# Altium project lp_ecg.PrjPcb
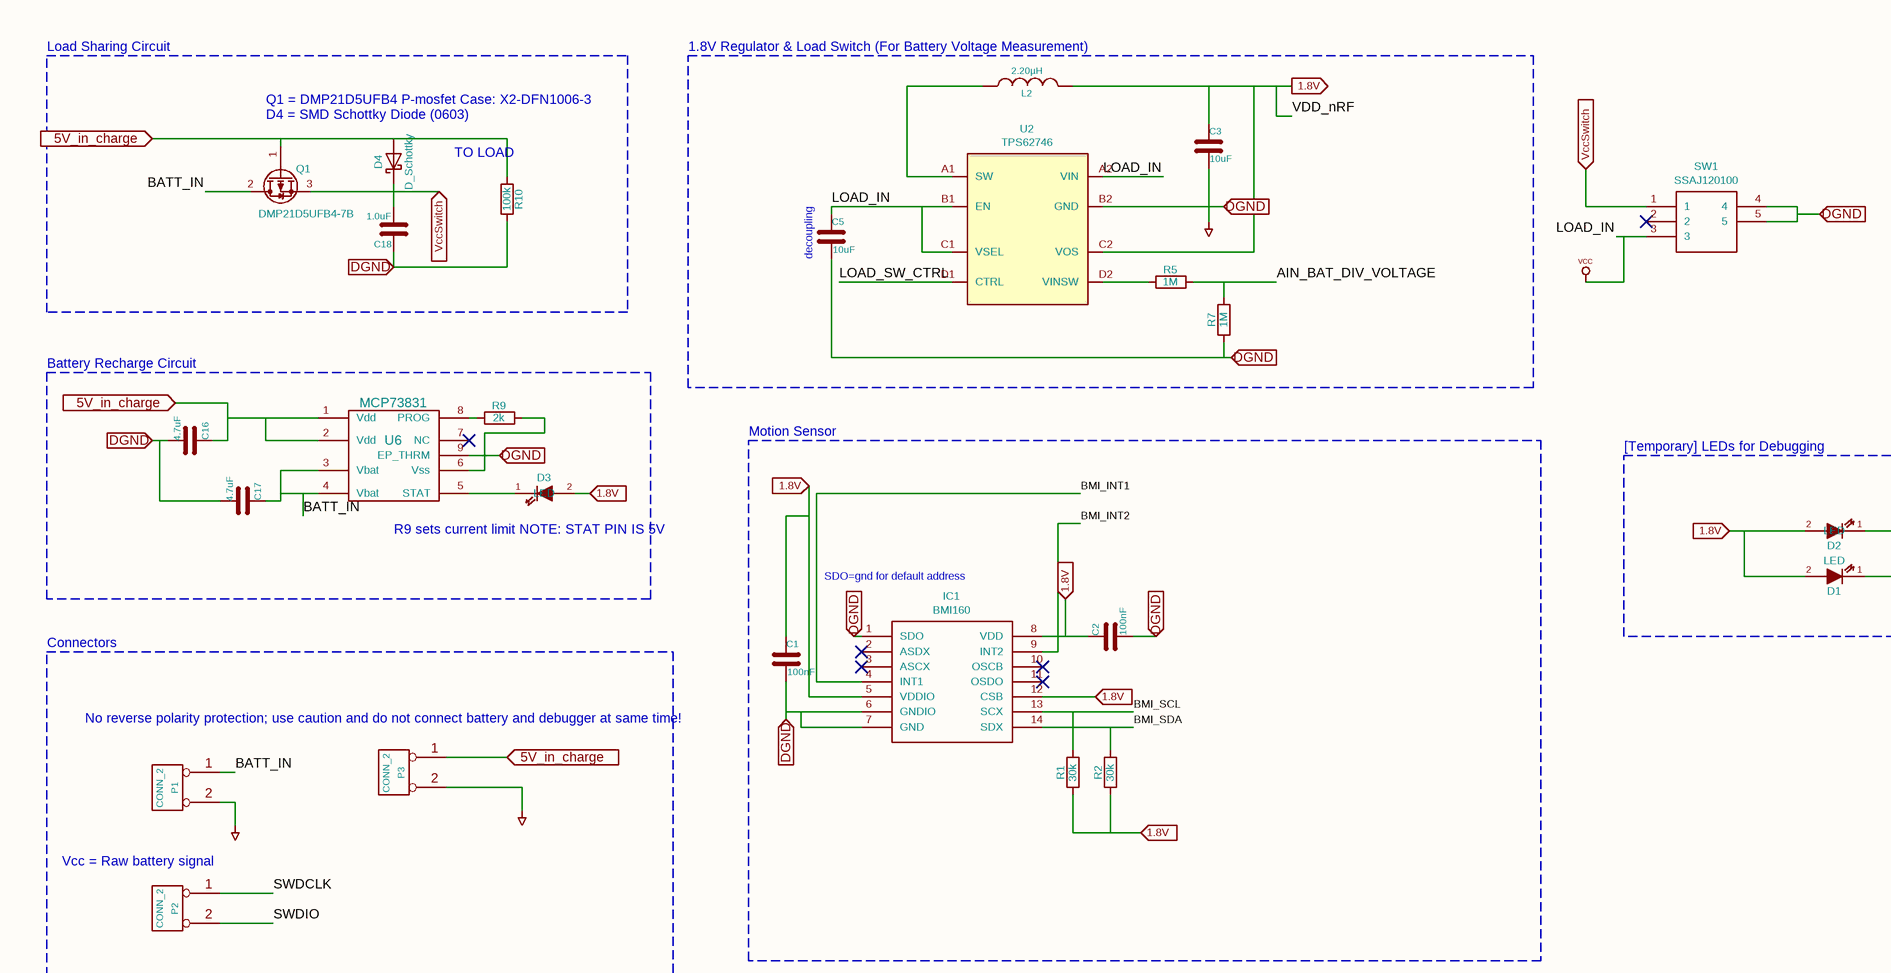
[diagram p0: lp_ecg.SchDoc, top left]
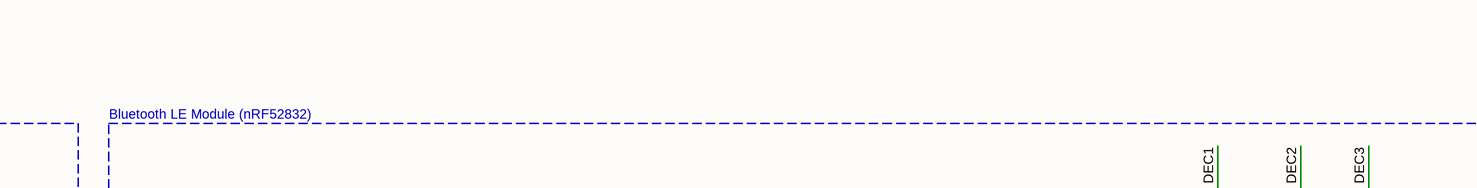
[diagram p1: lp_ecg.SchDoc, top right]
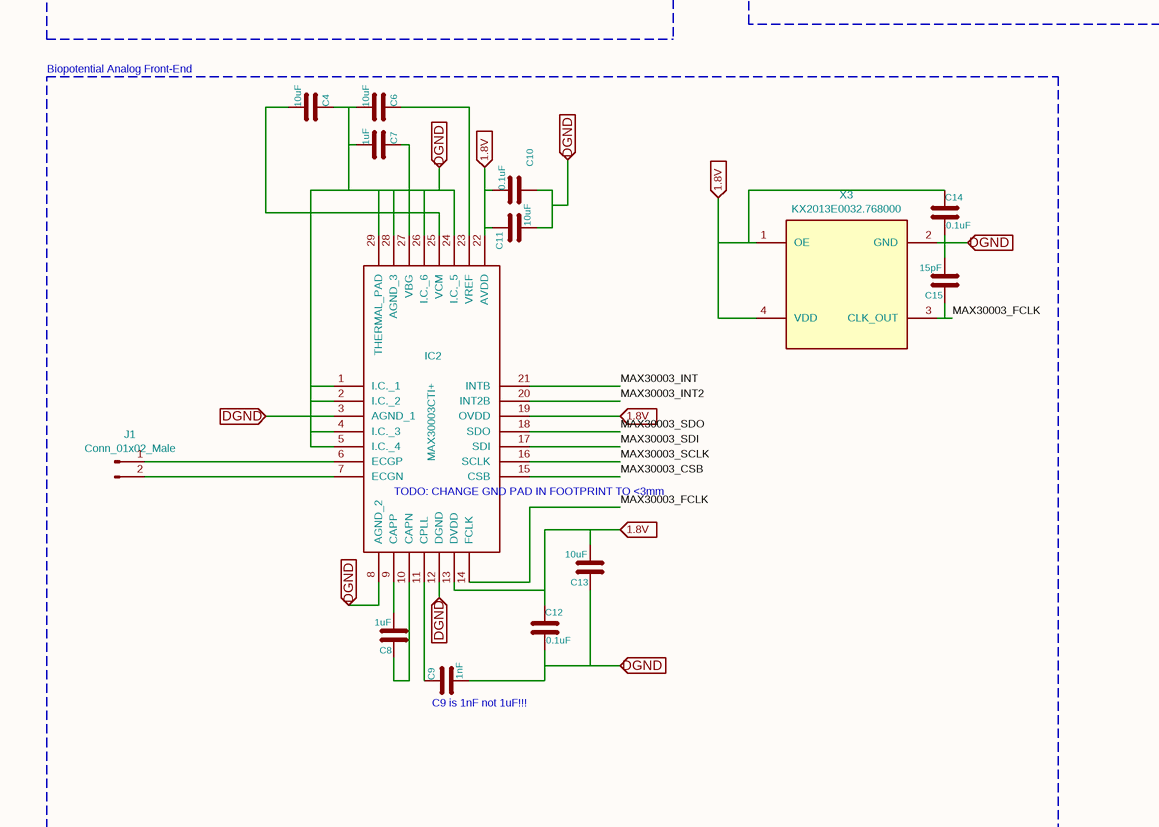
[diagram p2: lp_ecg.SchDoc, bottom left]
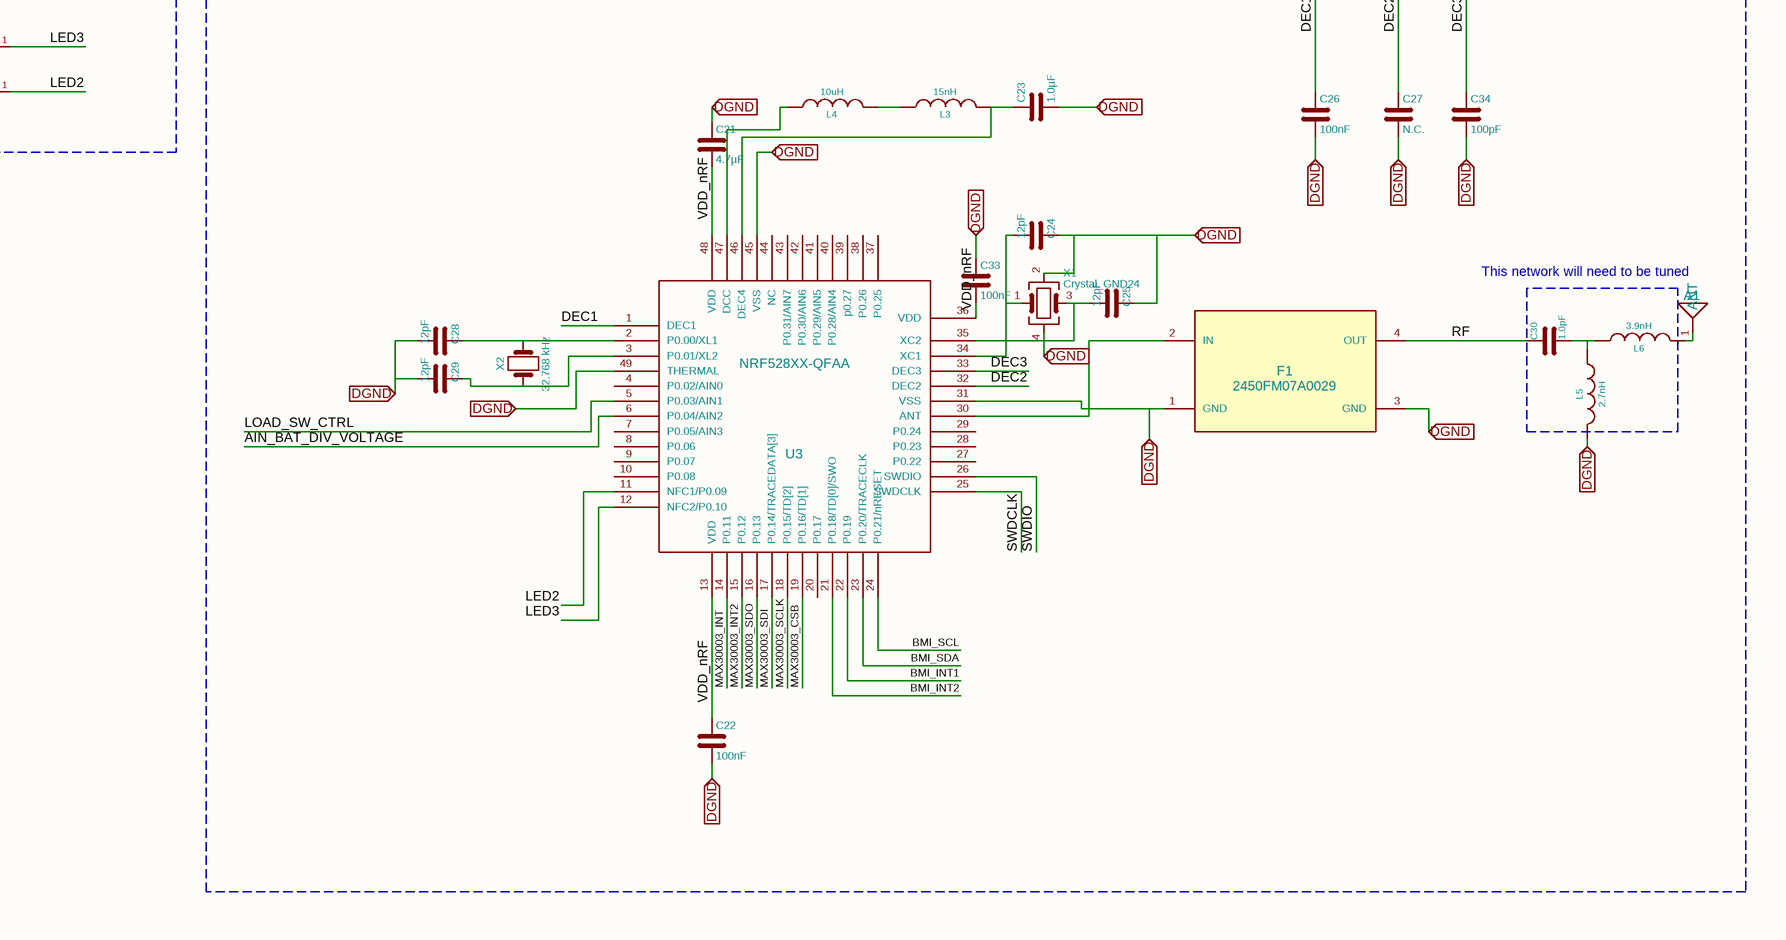
[diagram p3: lp_ecg.SchDoc, bottom right]
1 sheet, 61 parts. Net scope: flat (ports and power ports of the same name join across sheets).
Board files: lp_ecg.PcbDoc, lp_ecg(1).PcbDoc

## Sheet lp_ecg.SchDoc
size 840 x 594 mm

### Parts
A1  CHIP-ANT  (value not drawn)
C1  100nF  [C_0402]
C2  100nF  [C_0402]
C3  10uF  [C_0402]
C4  10uF  [C_0402]
C5  10uF  [C_0402]
C6  10uF  [C_0402]
C7  1uF  [C_0402]
C8  1uF  [C_0402]
C9  1nF  [C_0402]
C10  0.1uF  [C_0402]
C11  10uF  [C_0402]
C12  0.1uF  [C_0402]
C13  10uF  [C_0402]
C14  0.1uF  [C_0402]
C15  15pF  [C_0402]
C16  4.7uF  [C_0402]
C17  4.7uF  [C_0402]
C18  1.0uF  [C_0402]
C21  4.7µF  [C_0402]
C22  100nF  [C_0603]
C23  1.0µF  [C_0603]
C24  12pF  [C_0402]
C25  12pF  [C_0402]
C26  100nF  [C_0402]
C27  N.C.
C28  12pF  [C_0402]
C29  12pF  [C_0402]
C30  1.0pF  [C_0402]
C33  100nF  [C_0402]
C34  100pF  [C_0402]
D1  LED  [LED_0603]
D2  LED  [LED_0603]
D3  LED  [LED_0603]
D4  D_Schottky  [LED_0603]
F1  2450FM07A0029
IC1  BMI160  [BMI160]
IC2  MAX30003CTI+  [QFN50P500X500X80-29N]
J1  Conn_01x02_Male
L2  2.20µH  [L_0603]
L3  15nH  [L_0402]
L4  10uH  [L_0603]
L5  2.7nH  [L_0402]
L6  3.9nH  [L_0402]
P1  CONN_2  [Pin_Header_Straight_1x02_Pitch2.54mm]
P2  CONN_2  [Pin_Header_Straight_1x02_Pitch2.54mm]
P3  CONN_2  [Pin_Header_Straight_1x02_Pitch2.54mm]
Q1  DMP21D5UFB4-7B  [X2-DFN1006]
R1  30k  [R_0402]
R2  30k  [R_0402]
R5  1M  [R_0402]
R7  1M  [R_0402]
R9  2k  [R_0402]
R10  100k  [R_0402]
SW1  SSAJ120100  [SSAJ120100]
U2  TPS62746
U3  NRF528XX-QFAA  [UQFN-48-1EP_6x6mm_Pitch0.4mm]
U6  MCP73831  [DFN-8-1EP_2x3mm_Pitch0.5mm]
X1  Crystal_GND24  [Crystal_SMD_2016-4pin_2.0x1.6mm]
X2  32.768 kHz  [Crystal_SMD_2012-2pin_2.0x1.2mm]
X3  KX2013E0032.768000  [Crystal_SMD_2016-4pin_2.0x1.6mm]

### Blocks framed on the sheet
decoupling: C3 C5 L2 R5 R7 U2
Motion Sensor: C1 C2 IC1 R1 R2
[Temporary] LEDs for Debugging: D1 D2

### Ports
1.8V (in), 1.8V (out), 5V_in_charge (in), DGND (in), VccSwitch (in)

### Nets
GND: C1.2 C2.2 C3.2 C4.1 C5.2 C6.2 C7.2 C9.2 C10.1 C11.2 C12.2 C13.1 C14.2 C15.2 C16.2 C17.2 C18.1 C21.1 C22.2 C23.2 C24.1 C25.1 C26.2 C27.2 C28.2 C29.2 C33.1 C34.2 F1.1(GND) F1.2(IN) F1.3(GND) IC1.1(SDO) IC1.6(GNDIO) IC1.7(GND) IC2.1(I.C._1) IC2.2(I.C._2) IC2.3(AGND_1) IC2.4(I.C._3) IC2.5(I.C._4) IC2.8(AGND_2) IC2.12(DGND) IC2.24(I.C._5) IC2.26(I.C._6) IC2.28(AGND_3) IC2.29(THERMAL_PAD) L5.2 P1.2(PM) P3.2(PM) R7.1 R9.2 R10.2 SW1.4 SW1.5 U2.B2(GND) U3.30(ANT) U3.31(VSS) U3.45(VSS) U3.49(THERMAL) U6.6(Vss) U6.9(EP_THRM) X1.2 X1.4 X3.2(GND) ; port DGND
LOAD_IN: C5.1 SW1.3 U2.A2(VIN) U2.B1(EN) U2.C1(VSEL)  [also labelled VCC]
5V_in_charge: C16.1 D4.2(A) P3.1(P1) Q1.1(G) R10.1 U6.1(Vdd) U6.2(Vdd) ; port 5V_in_charge
AIN_BAT_DIV_VOLTAGE: R5.2 R7.2 U3.6(P0.04/AIN2)
BATT_IN: C17.1 P1.1(P1) Q1.2(D) U6.3(Vbat) U6.4(Vbat)
BMI_INT1: IC1.4(INT1) U3.22(P0.19)
BMI_INT2: IC1.9(INT2) U3.21(P0.18/TD[0]/SWO)
BMI_SCL: IC1.13(SCX) R1.2 U3.24(P0.21/nRESET)
BMI_SDA: IC1.14(SDX) R2.2 U3.23(P0.20/TRACECLK)
DEC1: C26.1 U3.1(DEC1)
DEC2: C27.1 U3.32(DEC2)
DEC3: C34.1 U3.33(DEC3)
LED2: D1.1(K) U3.11(NFC1/P0.09)
LED3: D2.1(K) U3.12(NFC2/P0.10)
LOAD_SW_CTRL: U2.D1(CTRL) U3.5(P0.03/AIN1)
MAX30003_CSB: IC2.15(CSB) U3.19(P0.16/TD[1])
MAX30003_FCLK: C15.1 IC2.14(FCLK) X3.3(CLK_OUT)
MAX30003_INT: IC2.21(INTB) U3.14(P0.11)
MAX30003_INT2: IC2.20(INT2B) U3.15(P0.12)
MAX30003_SCLK: IC2.16(SCLK) U3.18(P0.15/TD[2])
MAX30003_SDI: IC2.17(SDI) U3.17(P0.14/TRACEDATA[3])
MAX30003_SDO: IC2.18(SDO) U3.16(P0.13)
RF: C30.1 F1.4(OUT)
SWDCLK: P2.1(P1) U3.25(SWDCLK)
SWDIO: P2.2(PM) U3.26(SWDIO)
VccSwitch: C18.2 D4.1(K) Q1.3(S) SW1.1 ; port VccSwitch
VDD_nRF: C1.1 C2.1 C3.1 C10.2 C11.1 C12.1 C13.2 C14.1 C21.2 C22.1 C33.2 D1.2(A) D2.2(A) D3.2(A) IC1.5(VDDIO) IC1.8(VDD) IC1.12(CSB) IC2.13(DVDD) IC2.19(OVDD) IC2.22(AVDD) L2.2 R1.1 R2.1 U2.C2(VOS) U3.13(VDD) U3.36(VDD) U3.48(VDD) X3.1(OE) X3.4(VDD) ; port 1.8V
NetA1_1: A1.1(ANT) L6.2
NetC4_2: C4.2 IC2.25(VCM)
NetC6_1: C6.1 IC2.23(VREF)
NetC7_1: C7.1 IC2.27(VBG)
NetC8_1: C8.1 IC2.10(CAPN)
NetC8_2: C8.2 IC2.9(CAPP)
NetC9_1: C9.1 IC2.11(CPLL)
NetC23_1: C23.1 L3.2 U3.46(DEC4)
NetC24_2: C24.2 U3.34(XC1) X1.1
NetC25_2: C25.2 U3.35(XC2) X1.3
NetC28_1: C28.1 U3.2(P0.00/XL1) X2.2
NetC29_1: C29.1 U3.3(P0.01/XL2) X2.1
NetC30_2: C30.2 L5.1 L6.1
NetD3_1: D3.1(K) U6.5(STAT)
NetIC2_6: IC2.6(ECGP) J1.1(Pin_1)
NetIC2_7: IC2.7(ECGN) J1.2(Pin_2)
NetL2_1: L2.1 U2.A1(SW)
NetL3_1: L3.1 L4.2
NetL4_1: L4.1 U3.47(DCC)
NetR5_1: R5.1 U2.D2(VINSW)
NetR9_1: R9.1 U6.8(PROG)

Not connected (* = marked no-connect by the designer): A1 2(NC); IC1 2(ASDX)* 3(ASCX)* 10(OSCB)* 11(OSDO)*; SW1 2*; U3 4(P0.02/AIN0) 7(P0.05/AIN3) 8(P0.06) 9(P0.07) 10(P0.08) 20(P0.17) 27(P0.22) 28(P0.23) 29(P0.24) 37(P0.25) 38(P0.26) 39(p0.27) 40(P0.28/AIN4) 41(P0.29/AIN5) 42(P0.30/AIN6) 43(P0.31/AIN7) 44(NC); U6 7(NC)*

### Notes on the sheet
- Load Sharing Circuit
- (near L2) 1.8V Regulator & Load Switch (For Battery Voltage Measurement)
- Q1 = DMP21D5UFB4 P-mosfet
  Case: X2-DFN1006-3
- (near D4) D4 = SMD Schottky Diode (0603)
- (near R10) TO LOAD
- Battery Recharge Circuit
- Bluetooth LE Module (nRF52832)
- R9 sets current limit
  NOTE: STAT PIN IS 5V
- SDO=gnd for default address
- Connectors
- No reverse polarity protection;
  use caution and do not connect
  battery and debugger at same time!
- This network will need to be tuned
- (near P2) Vcc = Raw battery signal
- Biopotential Analog Front-End
- (near IC2) TODO: CHANGE GND PAD IN FOOTPRINT TO <3mm
- (near C9) C9 is 1nF not 1uF!!!
- 1
- 2
- 3
- 4
- 5
- 6
- 7
- 8
- 9
- 10
- 11
- 12
- 13
- 14
- 15
- 16
- A
- B
- C
- D
- E
- F
- G
- H
- I
- J
- K
- Title:
- File: lp_ecg.sch
- Sheet: /
- KiCad E.D.A.  kicad (5.1.4)-1
- Size: A1
- Date: 19 feb 2016
- Rev:
- Id: 1/1

### Library data of the parts
C1-C18 C21-C30 C33 C34 = C
  C1 C2 C26 C33: Value: 100nF; Footprint: Capacitors_SMD:C_0402
  C3-C6 C11 C13: Value: 10uF; Footprint: Capacitors_SMD:C_0402
  C7 C8: Value: 1uF; Footprint: Capacitors_SMD:C_0402
  C9: Value: 1nF; Footprint: Capacitors_SMD:C_0402
  C10 C12 C14: Value: 0.1uF; Footprint: Capacitors_SMD:C_0402
  C15: Value: 15pF; Footprint: Capacitors_SMD:C_0402
  C16 C17: Value: 4.7uF; Footprint: Capacitors_SMD:C_0402
  C18: Value: 1.0uF; Footprint: Capacitors_SMD:C_0402
  C21: Value: 4.7µF; Footprint: Capacitors_SMD:C_0402
  C22: Value: 100nF; Footprint: Capacitors_SMD:C_0603
  C23: Value: 1.0µF; Footprint: Capacitors_SMD:C_0603
  C24 C25 C28 C29: Value: 12pF; Footprint: Capacitors_SMD:C_0402
  C27: Value: N.C.
  C30: Value: 1.0pF; Footprint: Capacitors_SMD:C_0402
  C34: Value: 100pF; Footprint: Capacitors_SMD:C_0402
D1-D3 = LED-RESCUE-EEG_ADS1299_2: Value: LED; Footprint: LEDs:LED_0603
IC1 = BMI160: Manufacturer_Name: Bosch; Description: IMUs - Inertial Measurement Units 6-Axis 950uA; Height: 0.88; Mouser Part Number: 262-BMI160; Manufacturer_Part_Number: BMI160; Value: BMI160; Footprint: BMI160:BMI160
IC2 = MAX30003CTI+: Manufacturer_Name: Maxim Integrated; Description: MAXIM INTEGRATED PRODUCTS - MAX30003CTI+ - BIOPOTENTIAL AFE, ECG/R-R DETECT, TQFN28; Height: 0.8; Mouser Part Number: 700-MAX30003CTI+; Mouser Price/Stock: https://www.mouser.com/Search/Refine.aspx?Keyword=700-MAX30003CTI%2B; Manufacturer_Part_Number: MAX30003CTI+; Value: MAX30003CTI+; Footprint: MAX30003CTI+:QFN50P500X500X80-29N
L2-L6 = INDUCTOR
  L2: Value: 2.20µH; Footprint: Inductors_SMD:L_0603
  L3: Value: 15nH; Footprint: Inductors_SMD:L_0402
  L4: Value: 10uH; Footprint: Inductors_SMD:L_0603
  L5: Value: 2.7nH; Footprint: Inductors_SMD:L_0402
  L6: Value: 3.9nH; Footprint: Inductors_SMD:L_0402
Q1 = Q_PMOS_GDS: Value: DMP21D5UFB4-7B; Footprint: pwr_pads:X2-DFN1006
R1 R2 R5 R7 R9 R10 = R: Footprint: Resistors_SMD:R_0402
  R1 R2: Value: 30k
  R5 R7: Value: 1M
  R9: Value: 2k
  R10: Value: 100k
SW1 = SSAJ120100: Manufacturer_Name: ALPS; Description: Slide Switches 1-pole 2-positions Surface Mount Slide Switch SPDT Maintained 10 mA Slide; Mouser Part Number: 688-SSAJ120100; Mouser Price/Stock: https://www.mouser.com/Search/Refine.aspx?Keyword=688-SSAJ120100; Manufacturer_Part_Number: SSAJ120100; Value: SSAJ120100
U3 = NRF528XX-QFAA-RESCUE-EEG_ADS1299_2: Value: NRF528XX-QFAA; Footprint: Housings_DFN_QFN:UQFN-48-1EP_6x6mm_Pitch0.4mm
X2 = Crystal: Value: 32.768 kHz; Footprint: Crystals:Crystal_SMD_2012-2pin_2.0x1.2mm
A1 = CHIP-ANT: Value: CHIP-ANT
D4 = D_Schottky: Value: D_Schottky; Footprint: LEDs:LED_0603
F1 = 2450FM07A0029: Value: 2450FM07A0029
J1 = Conn_01x02_Male: Value: Conn_01x02_Male
P1-P3 = CONN_2: Value: CONN_2; Footprint: Pin_Headers:Pin_Header_Straight_1x02_Pitch2.54mm
U2 = TPS62746: Value: TPS62746
U6 = MCP73831: Value: MCP73831; Footprint: Housings_DFN_QFN:DFN-8-1EP_2x3mm_Pitch0.5mm
X1 = Crystal_GND24: Value: Crystal_GND24; Footprint: Crystals:Crystal_SMD_2016-4pin_2.0x1.6mm
X3 = KX2013E0032.768000: Value: KX2013E0032.768000; Footprint: Crystals:Crystal_SMD_2016-4pin_2.0x1.6mm